# Altium schematic sheet Righ_CH.SchDoc
size A
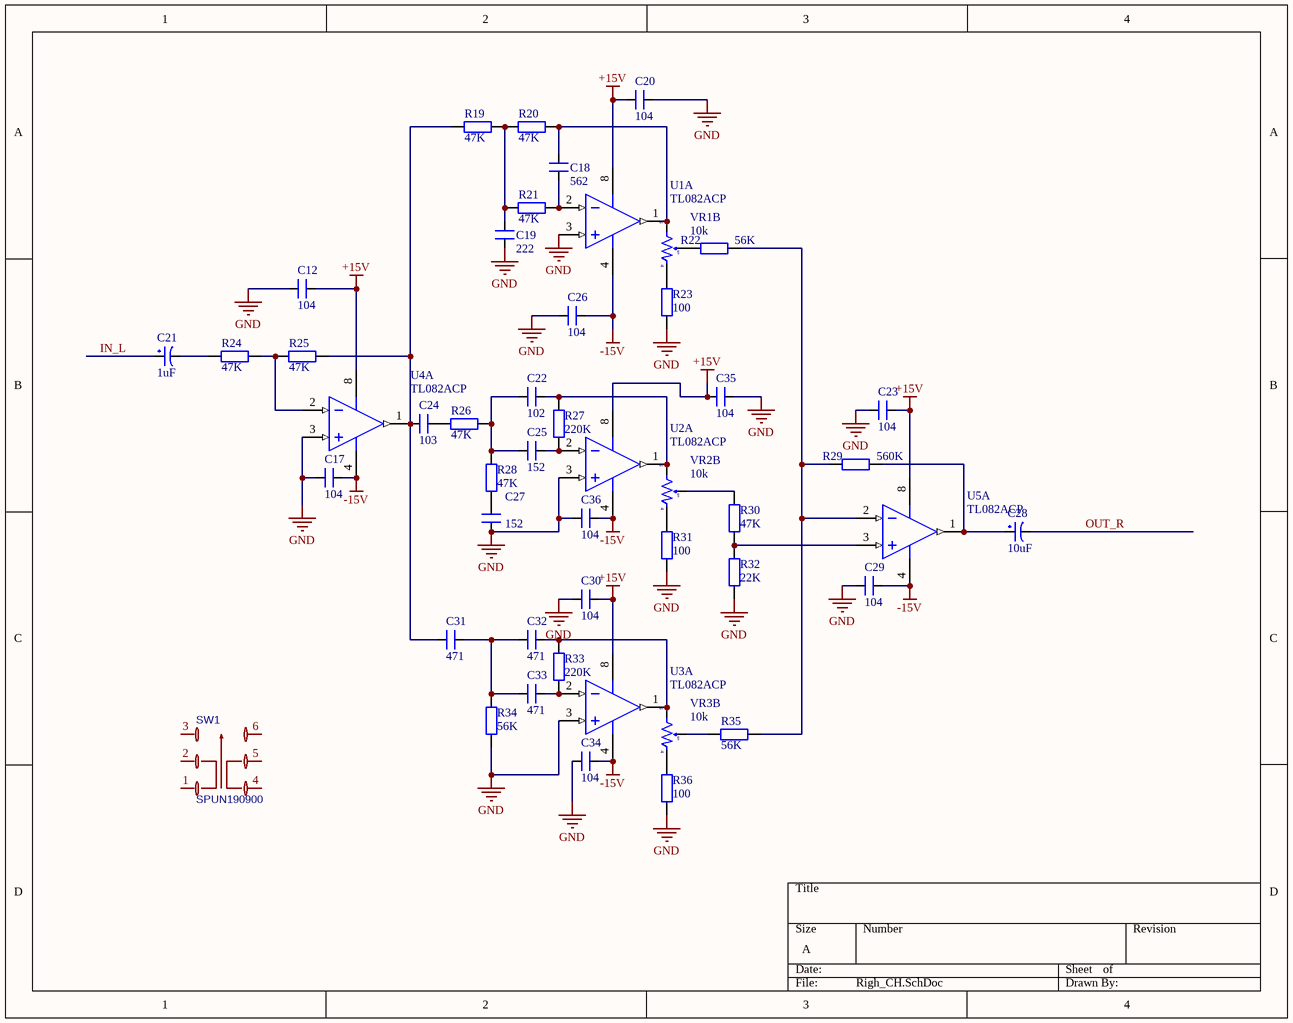
[diagram p0: Righ_CH.SchDoc]

## Parts
C12  104  [TU_GOM(104-->105pF)]
C17  104  [TU_GOM(104-->105pF)]
C18  562  [WIMA-FKP-2-1nF]
C19  222  [WIMA-FKP-2-1nF]
C20  104  [TU_GOM(104-->105pF)]
C21  1uF  [CP1/3.0]
C22  102  [WIMA-FKP-2-1nF]
C23  104  [TU_GOM(104-->105pF)]
C24  103  [WIMA-FKP-2-1nF]
C25  152  [WIMA-FKP-2-1nF]
C26  104  [TU_GOM(104-->105pF)]
C27  152  [WIMA-FKP-2-1nF]
C28  10uF  [CP1/3.0]
C29  104  [TU_GOM(104-->105pF)]
C30  104  [TU_GOM(104-->105pF)]
C31  471  [WIMA-FKP-2-1nF]
C32  471  [WIMA-FKP-2-1nF]
C33  471  [WIMA-FKP-2-1nF]
C34  104  [TU_GOM(104-->105pF)]
C35  104  [TU_GOM(104-->105pF)]
C36  104  [TU_GOM(104-->105pF)]
R19  47K  [TRO_VACH_ 1/4W]
R20  47K  [TRO_VACH_ 1/4W]
R21  47K  [TRO_VACH_ 1/4W]
R22  56K  [TRO_VACH_ 1/4W]
R23  100  [TRO_VACH_ 1/4W]
R24  47K  [TRO_VACH_ 1/4W]
R25  47K  [TRO_VACH_ 1/4W]
R26  47K  [TRO_VACH_ 1/4W]
R27  220K  [TRO_VACH_ 1/4W]
R28  47K  [TRO_VACH_ 1/4W]
R29  560K  [TRO_VACH_ 1/4W]
R30  47K  [TRO_VACH_ 1/4W]
R31  100  [TRO_VACH_ 1/4W]
R32  22K  [TRO_VACH_ 1/4W]
R33  220K  [TRO_VACH_ 1/4W]
R34  56K  [TRO_VACH_ 1/4W]
R35  56K  [TRO_VACH_ 1/4W]
R36  100  [TRO_VACH_ 1/4W]
SW1  SPUN190900  [SW-DIP-P42X10]
U1  TL082ACP  [DIP8]  (part A of 2)
U2  TL082ACP  [DIP8]  (part A of 2)
U3  TL082ACP  [DIP8]  (part A of 2)
U4  TL082ACP  [DIP8]  (part A of 2)
U5  TL082ACP  [DIP8]  (part A of 2)
VR1  10k  [9011]  (part B of 2)
VR2  10k  [9011]  (part B of 2)
VR3  10k  [9011]  (part B of 2)

## Nets
+15V: C12.2 C20.1 C23.2 C30.2 C35.2 U1.8(V+) U2.8(V+) U3.8(V+) U4.8(V+) U5.8(V+)
-15V: C17.2 C26.2 C29.2 C34.2 C36.1 U1.4(V-) U2.4(V-) U3.4(V-) U4.4(V-) U5.4(V-)
GND: C12.1 C17.1 C19.1 C20.2 C23.1 C26.1 C27.2 C29.1 C30.1 C34.1 C35.1 C36.2 R23.1 R31.1 R32.1 R34.1 R36.1 U1.3(IN+) U2.3(IN+) U3.3(IN+) U4.3(IN+)
IN_L: C21.1
OUT_R: C28.2
NetC18_1: C18.1 R21.2 U1.2(IN-)
NetC18_2: C18.2 R20.2 U1.1(OUT) VR1.6
NetC19_2: C19.2 R19.2 R20.1 R21.1
NetC21_2: C21.2 R24.1
NetC22_1: C22.1 R27.2 U2.1(OUT) VR2.6
NetC22_2: C22.2 C25.2 R26.1 R28.2
NetC24_1: C24.1 C31.2 R19.1 R25.2 U4.1(OUT)
NetC24_2: C24.2 R26.2
NetC25_1: C25.1 R27.1 U2.2(IN-)
NetC27_1: C27.1 R28.1
NetC28_1: C28.1 R29.1 U5.1(OUT)
NetC31_1: C31.1 C32.2 C33.2 R34.2
NetC32_1: C32.1 R33.2 U3.1(OUT) VR3.6
NetC33_1: C33.1 R33.1 U3.2(IN-)
NetR22_1: R22.1 R29.2 R35.1 U5.2(IN-)
NetR22_2: R22.2 VR1.5
NetR23_2: R23.2 VR1.4
NetR24_2: R24.2 R25.1 U4.2(IN-)
NetR30_1: R30.1 R32.2 U5.3(IN+)
NetR30_2: R30.2 VR2.5
NetR31_2: R31.2 VR2.4
NetR35_2: R35.2 VR3.5
NetR36_2: R36.2 VR3.4

Not connected (* = marked no-connect by the designer): SW1 1 2 3 4 5 6

## Library data of the parts
C12 C17-C20 C22-C27 C29-C36 = TU_MICA_ 104 100V(2A104J)_MH: Value: 0.1uF
C21 C28 = TU_HOA_4.7uF_100V_MH: Value: 4700uF/50V
R19-R36 = TRO_VACH_1/2W_MH: Resistor; Value: 1K; Published: 8-Jun-2000; LatestRevisionDate: 17-Jul-2002; LatestRevisionNote: Re-released for DXP Platform.; Publisher: Altium Limited
SW1 = SPUN190900: BOM_Manufacturer: ALPS Electric; Contributor: LCSC; BOM_Supplier: LCSC; BOM_Supplier Part: C278339; BOM_Manufacturer Part: SPUN190900; spicePre: S
U1-U5 = TL082ACP: JFET-Input Operational Amplifier; Published: 17-Jul-2002; LatestRevisionDate: 06-Jun-2005; LatestRevisionNote: Stylized 3D Model Added.; DatasheetVersion: 1988; PackageReference: 626-05; Publisher: Altium Limited; PackageDescription: DIP; 8 Leads; Row Spacing 7.62 mm; Pitch 2.54 mm; ComponentLink1Description: Manufacturer Link; ComponentLink1URL: http://www.onsemi.com/site/products/parametrics/0,4446,251,00.html
VR1-VR3 = Triet Ap Doi 10k_MH: Triet Ap Doi 10k